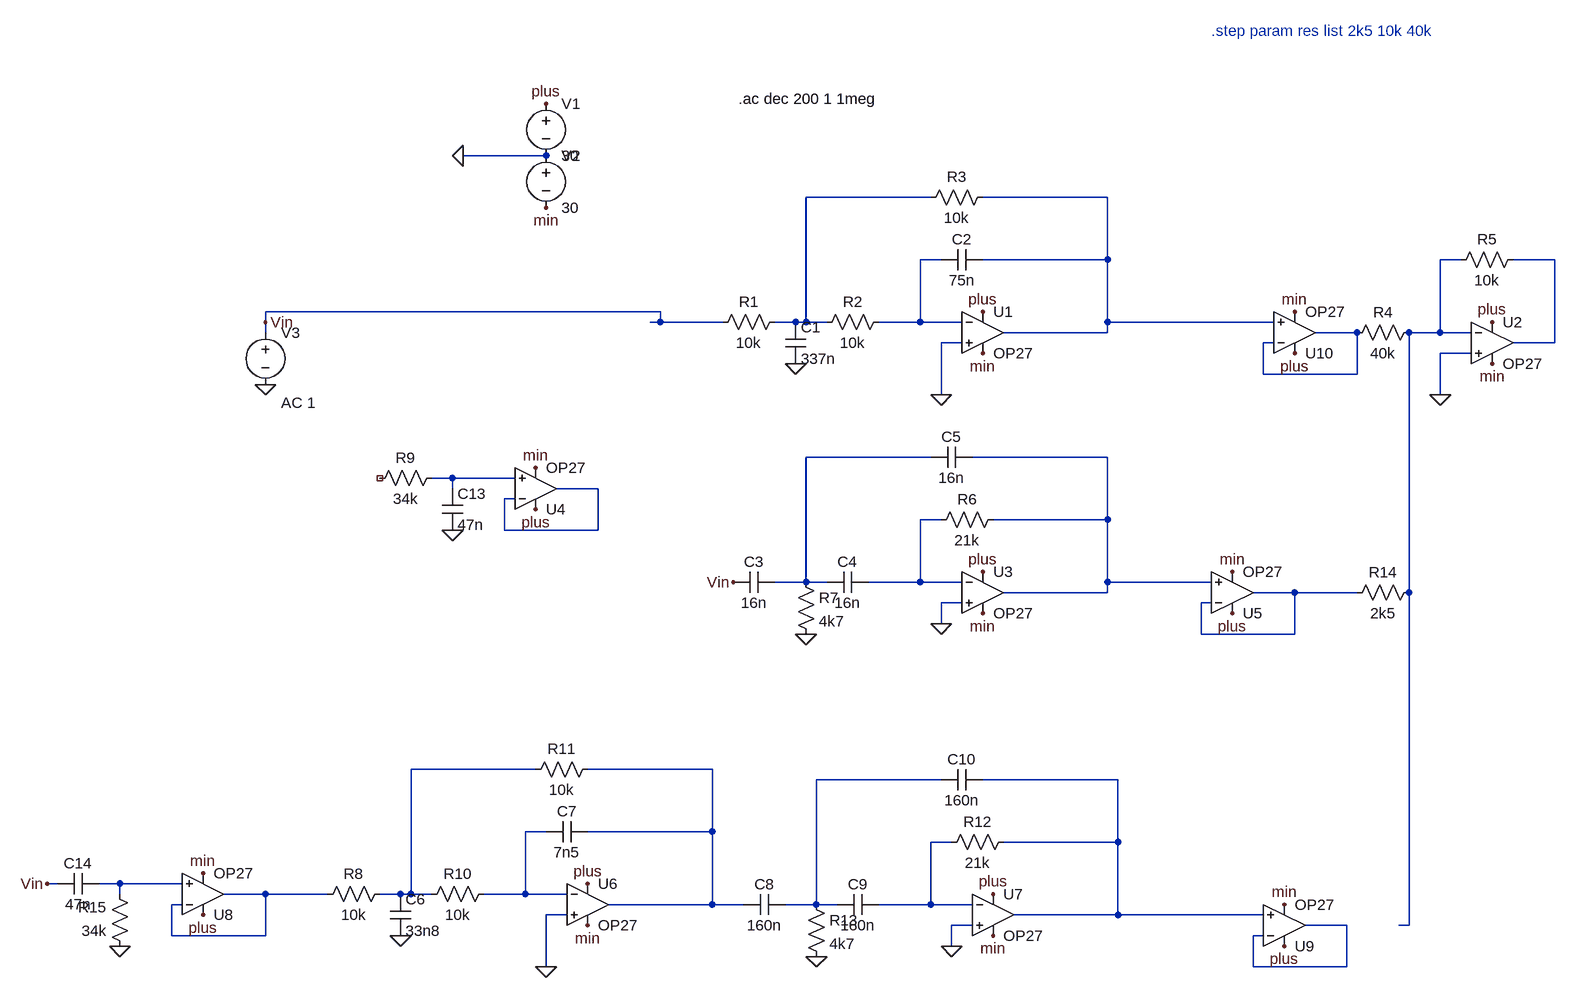
[diagram p0: schematic MFB-Filter.asc]
MFB-Filter.asc, the LTspice schematic file:
Version 4.1
SHEET 1 1204 1164
WIRE -352 -144 -480 -144
WIRE 240 -80 48 -80
WIRE 512 -80 320 -80
WIRE 256 16 224 16
WIRE 512 16 512 -80
WIRE 512 16 320 16
WIRE 1056 16 1024 16
WIRE 1200 16 1136 16
WIRE -176 96 -784 96
WIRE -784 112 -784 96
WIRE -176 112 -176 96
WIRE -176 112 -192 112
WIRE -80 112 -176 112
WIRE 32 112 0 112
WIRE 48 112 48 -80
WIRE 48 112 32 112
WIRE 80 112 48 112
WIRE 224 112 224 16
WIRE 224 112 160 112
WIRE 288 112 224 112
WIRE 512 112 512 16
WIRE 768 112 512 112
WIRE -784 128 -784 112
WIRE 512 128 512 112
WIRE 512 128 352 128
WIRE 896 128 832 128
WIRE 1024 128 1024 16
WIRE 1024 128 976 128
WIRE 1072 128 1024 128
WIRE 288 144 256 144
WIRE 768 144 752 144
WIRE 1200 144 1200 16
WIRE 1200 144 1136 144
WIRE 1072 160 1024 160
WIRE 752 192 752 144
WIRE 896 192 896 128
WIRE 896 192 752 192
WIRE 256 224 256 144
WIRE 1024 224 1024 160
WIRE 240 320 48 320
WIRE 512 320 304 320
WIRE -496 352 -528 352
WIRE -400 352 -496 352
WIRE -496 368 -496 352
WIRE -272 368 -336 368
WIRE -400 384 -416 384
WIRE 256 416 224 416
WIRE 512 416 512 320
WIRE 512 416 336 416
WIRE -416 432 -416 384
WIRE -272 432 -272 368
WIRE -272 432 -416 432
WIRE 48 512 48 320
WIRE 48 512 0 512
WIRE 80 512 48 512
WIRE 224 512 224 416
WIRE 224 512 144 512
WIRE 288 512 224 512
WIRE 512 512 512 416
WIRE 672 512 512 512
WIRE 512 528 512 512
WIRE 512 528 352 528
WIRE 800 528 736 528
WIRE 896 528 800 528
WIRE 976 528 976 128
WIRE 288 544 256 544
WIRE 672 544 656 544
WIRE 256 576 256 544
WIRE 656 592 656 544
WIRE 800 592 800 528
WIRE 800 592 656 592
WIRE -368 800 -560 800
WIRE -96 800 -288 800
WIRE 256 816 64 816
WIRE 528 816 320 816
WIRE -352 896 -384 896
WIRE -96 896 -96 800
WIRE -96 896 -288 896
WIRE 272 912 240 912
WIRE 528 912 528 816
WIRE 528 912 352 912
WIRE -1104 976 -1120 976
WIRE -1008 976 -1040 976
WIRE -912 976 -1008 976
WIRE -1008 992 -1008 976
WIRE -784 992 -848 992
WIRE -688 992 -784 992
WIRE -576 992 -608 992
WIRE -560 992 -560 800
WIRE -560 992 -576 992
WIRE -528 992 -560 992
WIRE -384 992 -384 896
WIRE -384 992 -448 992
WIRE -320 992 -384 992
WIRE -912 1008 -928 1008
WIRE -96 1008 -96 896
WIRE -96 1008 -256 1008
WIRE -48 1008 -96 1008
WIRE 64 1008 64 816
WIRE 64 1008 16 1008
WIRE 96 1008 64 1008
WIRE 240 1008 240 912
WIRE 240 1008 160 1008
WIRE 304 1008 240 1008
WIRE -320 1024 -352 1024
WIRE 528 1024 528 912
WIRE 528 1024 368 1024
WIRE 752 1024 528 1024
WIRE 304 1040 272 1040
WIRE 880 1040 816 1040
WIRE 976 1040 976 528
WIRE 976 1040 960 1040
WIRE -928 1056 -928 1008
WIRE -784 1056 -784 992
WIRE -784 1056 -928 1056
WIRE 752 1056 736 1056
WIRE 272 1072 272 1040
WIRE -352 1104 -352 1024
WIRE 736 1104 736 1056
WIRE 880 1104 880 1040
WIRE 880 1104 736 1104
FLAG -480 -144 0
FLAG -352 -64 min
FLAG -352 -224 plus
FLAG -784 208 0
FLAG 32 176 0
FLAG 320 160 min
FLAG 320 96 plus
FLAG 256 224 0
FLAG 1104 176 min
FLAG 1104 112 plus
FLAG 1024 224 0
FLAG 320 560 min
FLAG 320 496 plus
FLAG 48 592 0
FLAG 256 576 0
FLAG -784 112 Vin
FLAG -64 512 Vin
FLAG 704 560 plus
FLAG 704 496 min
FLAG -576 1056 0
FLAG -288 1040 min
FLAG -288 976 plus
FLAG -352 1104 0
FLAG 336 1056 min
FLAG 336 992 plus
FLAG 64 1088 0
FLAG 272 1072 0
FLAG -1120 976 Vin
FLAG -368 400 plus
FLAG -368 336 min
FLAG -496 432 0
FLAG -880 1024 plus
FLAG -880 960 min
FLAG -1008 1072 0
FLAG 784 1072 plus
FLAG 784 1008 min
FLAG 800 160 plus
FLAG 800 96 min
SYMBOL voltage -352 -240 R0
WINDOW 123 0 0 Left 0
WINDOW 39 0 0 Left 0
SYMATTR InstName V1
SYMATTR Value 30
SYMBOL voltage -352 -160 R0
WINDOW 123 0 0 Left 0
WINDOW 39 0 0 Left 0
SYMATTR InstName V2
SYMATTR Value 30
SYMBOL voltage -784 112 R0
WINDOW 123 24 124 Left 2
WINDOW 39 0 0 Left 0
SYMATTR Value2 AC 1
SYMATTR InstName V3
SYMATTR Value ""
SYMBOL res 16 96 R90
WINDOW 0 0 56 VBottom 2
WINDOW 3 32 56 VTop 2
SYMATTR InstName R1
SYMATTR Value 10k
SYMBOL res 176 96 R90
WINDOW 0 0 56 VBottom 2
WINDOW 3 32 56 VTop 2
SYMATTR InstName R2
SYMATTR Value 10k
SYMBOL cap 16 112 R0
SYMATTR InstName C1
SYMATTR Value 337n
SYMBOL cap 320 0 R90
WINDOW 0 0 32 VBottom 2
WINDOW 3 32 32 VTop 2
SYMATTR InstName C2
SYMATTR Value 75n
SYMBOL res 336 -96 R90
WINDOW 0 0 56 VBottom 2
WINDOW 3 32 56 VTop 2
SYMATTR InstName R3
SYMATTR Value 10k
SYMBOL OpAmps\\OP27 320 64 R0
SYMATTR InstName U1
SYMBOL OpAmps\\OP27 1104 80 R0
SYMATTR InstName U2
SYMBOL res 992 112 R90
WINDOW 0 0 56 VBottom 2
WINDOW 3 32 56 VTop 2
SYMATTR InstName R4
SYMATTR Value 40k
SYMBOL res 1152 0 R90
WINDOW 0 0 56 VBottom 2
WINDOW 3 32 56 VTop 2
SYMATTR InstName R5
SYMATTR Value 10k
SYMBOL OpAmps\\OP27 320 464 R0
SYMATTR InstName U3
SYMBOL cap 0 496 R90
WINDOW 0 0 32 VBottom 2
WINDOW 3 32 32 VTop 2
SYMATTR InstName C3
SYMATTR Value 16n
SYMBOL cap 144 496 R90
WINDOW 0 0 32 VBottom 2
WINDOW 3 32 32 VTop 2
SYMATTR InstName C4
SYMATTR Value 16n
SYMBOL cap 304 304 R90
WINDOW 0 0 32 VBottom 2
WINDOW 3 32 32 VTop 2
SYMATTR InstName C5
SYMATTR Value 16n
SYMBOL res 352 400 R90
WINDOW 0 0 56 VBottom 2
WINDOW 3 32 56 VTop 2
SYMATTR InstName R6
SYMATTR Value 21k
SYMBOL res 32 496 R0
SYMATTR InstName R7
SYMATTR Value 4k7
SYMBOL OpAmps\\OP27 704 592 M180
SYMATTR InstName U5
SYMBOL res -592 976 R90
WINDOW 0 0 56 VBottom 2
WINDOW 3 32 56 VTop 2
SYMATTR InstName R8
SYMATTR Value 10k
SYMBOL res -432 976 R90
WINDOW 0 0 56 VBottom 2
WINDOW 3 32 56 VTop 2
SYMATTR InstName R10
SYMATTR Value 10k
SYMBOL cap -592 992 R0
SYMATTR InstName C6
SYMATTR Value 33n8
SYMBOL cap -288 880 R90
WINDOW 0 0 32 VBottom 2
WINDOW 3 32 32 VTop 2
SYMATTR InstName C7
SYMATTR Value 7n5
SYMBOL res -272 784 R90
WINDOW 0 0 56 VBottom 2
WINDOW 3 32 56 VTop 2
SYMATTR InstName R11
SYMATTR Value 10k
SYMBOL OpAmps\\OP27 -288 944 R0
SYMATTR InstName U6
SYMBOL OpAmps\\OP27 336 960 R0
SYMATTR InstName U7
SYMBOL cap 16 992 R90
WINDOW 0 0 32 VBottom 2
WINDOW 3 32 32 VTop 2
SYMATTR InstName C8
SYMATTR Value 160n
SYMBOL cap 160 992 R90
WINDOW 0 0 32 VBottom 2
WINDOW 3 32 32 VTop 2
SYMATTR InstName C9
SYMATTR Value 160n
SYMBOL cap 320 800 R90
WINDOW 0 0 32 VBottom 2
WINDOW 3 32 32 VTop 2
SYMATTR InstName C10
SYMATTR Value 160n
SYMBOL res 368 896 R90
WINDOW 0 0 56 VBottom 2
WINDOW 3 32 56 VTop 2
SYMATTR InstName R12
SYMATTR Value 21k
SYMBOL res 48 992 R0
SYMATTR InstName R13
SYMATTR Value 4k7
SYMBOL res 992 512 R90
WINDOW 0 0 56 VBottom 2
WINDOW 3 32 56 VTop 2
SYMATTR InstName R14
SYMATTR Value 2k5
SYMBOL OpAmps\\OP27 -368 432 M180
SYMATTR InstName U4
SYMBOL res -512 336 R90
WINDOW 0 0 56 VBottom 2
WINDOW 3 32 56 VTop 2
SYMATTR InstName R9
SYMATTR Value 34k
SYMBOL cap -512 368 R0
SYMATTR InstName C13
SYMATTR Value 47n
SYMBOL OpAmps\\OP27 -880 1056 M180
SYMATTR InstName U8
SYMBOL res -992 1088 R180
WINDOW 0 36 76 Left 2
WINDOW 3 36 40 Left 2
SYMATTR InstName R15
SYMATTR Value 34k
SYMBOL cap -1040 960 R90
WINDOW 0 0 32 VBottom 2
WINDOW 3 32 32 VTop 2
SYMATTR InstName C14
SYMATTR Value 47n
SYMBOL OpAmps\\OP27 784 1104 M180
SYMATTR InstName U9
SYMBOL OpAmps\\OP27 800 192 M180
SYMATTR InstName U10
TEXT -56 -232 Left 2 !.ac dec 200 1 1meg
TEXT 672 -336 Left 2 ;.step param res list 2k5 10k 40k

The netlist it stands for:
* MFB-Filter.asc
V1 plus 0 30
V2 0 min 30
V3 Vin 0 AC 1
R1 N001 Vin 10k
R2 N003 N001 10k
C1 N001 0 337n
C2 N002 N003 75n
R3 N002 N001 10k
X§U1 0 N003 plus min N002 OP27  ; pins In+ In- V+ V- OUT
X§U2 0 N004 plus min N005 OP27  ; pins In+ In- V+ V- OUT
R4 N004 N006 40k
R5 N005 N004 10k
X§U3 0 N011 plus min N008 OP27  ; pins In+ In- V+ V- OUT
C3 N007 Vin 16n
C4 N011 N007 16n
C5 N008 N007 16n
R6 N008 N011 21k
R7 N007 0 4k7
X§U5 N008 N012 plus min N012 OP27  ; pins In+ In- V+ V- OUT
R8 N013 N020 10k
R10 N017 N013 10k
C6 N013 0 33n8
C7 N014 N017 7n5
R11 N014 N013 10k
X§U6 0 N017 plus min N014 OP27  ; pins In+ In- V+ V- OUT
X§U7 0 N018 plus min N016 OP27  ; pins In+ In- V+ V- OUT
C8 N015 N014 160n
C9 N018 N015 160n
C10 N016 N015 160n
R12 N016 N018 21k
R13 N015 0 4k7
R14 N004 N012 2k5
X§U4 N009 N010 plus min N010 OP27  ; pins In+ In- V+ V- OUT
R9 N009 NC_01 34k
C13 N009 0 47n
X§U8 N019 N020 plus min N020 OP27  ; pins In+ In- V+ V- OUT
R15 0 N019 34k
C14 N019 Vin 47n
X§U9 N016 N021 plus min N021 OP27  ; pins In+ In- V+ V- OUT
X§U10 N002 N006 plus min N006 OP27  ; pins In+ In- V+ V- OUT
.ac dec 200 1 1meg
* .step param res list 2k5 10k 40k
.lib ADI.lib
.backanno
.end